# Altium schematic sheet ADCMP.SchDoc
size A4; SheetNumber: 2; SheetTotal: 5
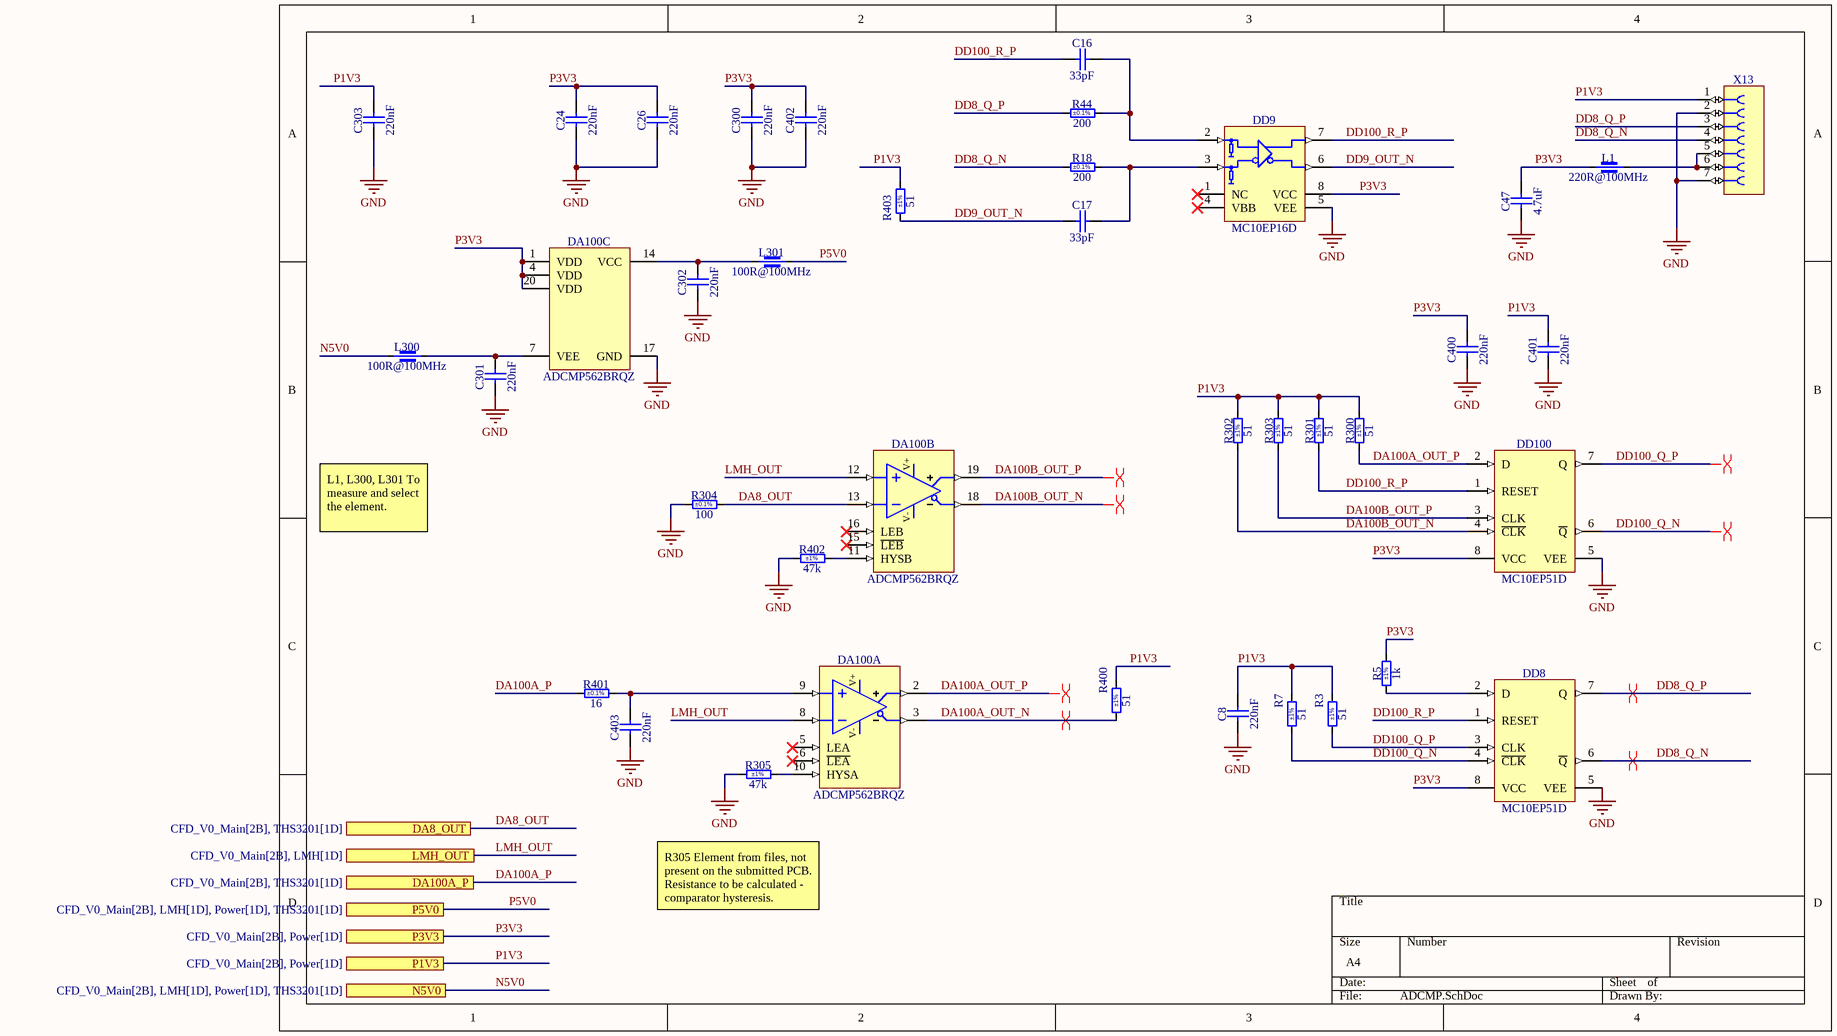
[diagram p0: ADCMP.SchDoc]

## Parts
C8  220nF  [CAPC2012X135N]
C16  33pF  [CAPC2012X135N]
C17  33pF  [CAPC2012X135N]
C24  220nF  [CAPC2012X135N]
C26  220nF  [CAPC2012X135N]
C47  4.7uF  [CAPC3216X180N]
C300  220nF  [CAPC1608X87N]
C301  220nF  [CAPC1608X87N]
C302  220nF  [CAPC1608X87N]
C303  220nF  [CAPC2012X135N]
C400  220nF  [CAPC2012X135N]
C401  220nF  [CAPC2012X135N]
C402  220nF  [CAPC1608X87N]
C403  220nF  [CAPC1608X87N]
DA100  ADCMP562BRQZ  [SOP63P600X175-20AN]  (parts A,B,C of 3)
DD8  MC10EP51D  [SOIC127P600X175-8N]
DD9  MC10EP16D  [SOIC127P600X175-8N]
DD100  MC10EP51D  [SOIC127P600X175-8N]
L1  220R@100MHz  [INDC2012X105N]
L300  100R@100MHz  [INDC1608X75N]
L301  100R@100MHz  [INDC1608X75N]
R3  51  Tolerance: ±1%  [RESC2012X60N]
R5  1k  Tolerance: ±1%  [RESC2012X60N]
R7  51  Tolerance: ±1%  [RESC2012X60N]
R18  200  Tolerance: ±0.1%  [RESC2012X60N]
R44  200  Tolerance: ±0.1%  [RESC2012X60N]
R300  51  Tolerance: ±1%  [RESC2012X60N]
R301  51  Tolerance: ±1%  [RESC2012X60N]
R302  51  Tolerance: ±1%  [RESC2012X60N]
R303  51  Tolerance: ±1%  [RESC2012X60N]
R304  100  Tolerance: ±0.1%  [RESC1608X55N]
R305  47k  Tolerance: ±1%  [RESC1608X55N]
R400  51  Tolerance: ±1%  [RESC2012X60N]
R401  16  Tolerance: ±0.1%  [RESC1608X64N]
R402  47k  Tolerance: ±1%  [RESC1608X55N]
R403  51  Tolerance: ±1%  [RESC2012X60N]
X13  Socket 7  [SAMTEC_CES-107-01-T-S]  (value not drawn)

## Ports
DA8_OUT (see CFD_V0_Main[2B], THS3201[1D]), DA100A_P (see CFD_V0_Main[2B], THS3201[1D]), LMH_OUT (see CFD_V0_Main[2B], LMH[1D]), N5V0 (see CFD_V0_Main[2B], LMH[1D], Power[1D], THS3201[1D]), P1V3 (see CFD_V0_Main[2B], Power[1D]), P3V3 (see CFD_V0_Main[2B], Power[1D]), P5V0 (see CFD_V0_Main[2B], LMH[1D], Power[1D], THS3201[1D])

## Nets
GND: C8.1 C24.1 C26.1 C47.1 C300.1 C301.1 C302.1 C303.1 C400.1 C401.1 C402.1 C403.1 DA100.17(GND) DD8.5(VEE) DD9.5(VEE) DD100.5(VEE) R304.1 R305.1 R402.1 X13.2 X13.7
DA8_OUT: DA100.13(-INB) R304.2 ; port DA8_OUT
DA100A_OUT_N: DA100.3(~{QA}) R400.1
DA100A_OUT_P: DA100.2(QA) DD100.2(D) R300.1
DA100A_P: R401.1 ; port DA100A_P
DA100B_OUT_N: DA100.18(~{QB}) DD100.4(~{CLK}) R302.1
DA100B_OUT_P: DA100.19(QB) DD100.3(CLK) R303.1
DD8_Q_N: DD8.6(~{Q}) R18.1 X13.4
DD8_Q_P: DD8.7(Q) R44.1 X13.3
DD9_OUT_N: C17.1 DD9.6(~{Q}) R403.1
DD100_Q_N: DD8.4(~{CLK}) DD100.6(~{Q}) R7.1
DD100_Q_P: DD8.3(CLK) DD100.7(Q) R3.1
DD100_R_P: C16.1 DD8.1(RESET) DD9.7(Q) DD100.1(RESET) R301.1
LMH_OUT: DA100.8(-INA) DA100.12(+INB) ; port LMH_OUT
N5V0: L300.1 ; port N5V0
P1V3: C8.2 C303.2 C401.2 R3.2 R7.2 R300.2 R301.2 R302.2 R303.2 R400.2 R403.2 X13.1 ; port P1V3
P3V3: C24.2 C26.2 C47.2 C300.2 C400.2 C402.2 DA100.1(VDD) DA100.4(VDD) DA100.20(VDD) DD8.8(VCC) DD9.8(VCC) DD100.8(VCC) L1.1 R5.2 ; port P3V3
P5V0: L301.2 ; port P5V0
NetC16_2: C16.2 DD9.2(D0) R44.2
NetC17_2: C17.2 DD9.3(~{D0}) R18.2
NetC301_2: C301.2 DA100.7(VEE) L300.2
NetC302_2: C302.2 DA100.14(VCC) L301.1
NetC403_2: C403.2 DA100.9(+INA) R401.2
NetDA100_10: DA100.10(HYSA) R305.2
NetDA100_11: DA100.11(HYSB) R402.2
NetDD8_2: DD8.2(D) R5.1
NetL1_2: L1.2 X13.5 X13.6

Not connected (* = marked no-connect by the designer): DA100 5(LEA)* 6(~{LEA})* 15(~{LEB})* 16(LEB)*; DD9 1(NC)* 4(VBB)*

## Layout directives
differential pair: DA100A_OUT_N, DA100A_OUT_P, DA100B_OUT_N, DA100B_OUT_P, DD8_Q_N, DD8_Q_P, DD100_Q_N, DD100_Q_P

## Notes on the sheet
- L1, L300, L301 To measure and select the element.
- R305 Element from files, not present on the submitted PCB. Resistance to be calculated - comparator hysteresis.
- (in symbol ADCMP562BRQZ, part A) V+; V-
- (in symbol ADCMP562BRQZ, part B) V+; V-

## Library data of the parts
C8 C24 C26 C303 C400 C401 = CC0805_220NF_50V_10%_X7R: Non-polarised capacitor; Part Description: SMD Multilayer Chip Ceramic Capacitor; Manufacturer: GENERIC; Manufacturer1 Part Number: GRM21BR71H224KA01L; Voltage: 50V; TC: X7R; Tolerance: ±10%; Part Number: CC0805_220NF_50V_10%_X7R; Component Kind: Standard; Component Type: Standard; Pin Count: 2; Value: 220nF; Status: Preferred; Manufacturer Part Number: CC0805_220NF_50V_10%_X7R; Case: 0805; Mounted: Yes; Socket: No; SMD: Yes; Sense: No; Manufacturer1 Example: MURATA; Manufacturer1 ComponentHeight: 1.35mm; HelpURL: \\cern.ch\dfs\Applications\Altium\Datasheets\CC0805_X7R_MURATA.pdf; Author: CERN DEM JLC; CreateDate: 03.12.2007; LatestRevisionDate: 03.12.2007
C16 C17 = CC0805_33PF_50V_5%_NP0: Non-polarised capacitor; Part Description: SMD Multilayer Chip Ceramic Capacitor; Manufacturer: GENERIC; Manufacturer1 Part Number: 223886115339; Voltage: 50V; TC: C0G/NP0; Tolerance: ±5%; Part Number: CC0805_33PF_50V_5%_NP0; Component Kind: Standard; Component Type: Standard; Pin Count: 2; Value: 33pF; Status: Preferred; Manufacturer Part Number: CC0805_33PF_50V_5%_NP0; Case: 0805; Mounted: Yes; Socket: No; SMD: Yes; Sense: No; Manufacturer1 Example: PHYCOMP; Manufacturer1 ComponentHeight: 1.35mm; HelpURL: \\cern.ch\dfs\Applications\Altium\Datasheets\CC0805_NP0_PHYCOMP.pdf; Author: CERN DEM JLC; CreateDate: 03.12.2007; LatestRevisionDate: 03.12.2007
C47 = CC1206_4.7UF_25V_10%_X7R: Non-polarised capacitor; Part Description: SMD Multilayer Chip Ceramic Capacitor; Manufacturer: GENERIC; Manufacturer1 Part Number: C1206C475K3RAC; Voltage: 25V; TC: X7R; Tolerance: ±10%; Part Number: CC1206_4.7UF_25V_10%_X7R; Component Kind: Standard; Component Type: Standard; Pin Count: 2; Value: 4.7uF; Status: Preferred; Manufacturer Part Number: CC1206_4.7UF_25V_10%_X7R; Case: 1206; Mounted: Yes; Socket: No; SMD: Yes; Sense: No; Manufacturer1 Example: KEMET; Manufacturer1 ComponentHeight: 1.8mm; HelpURL: \\cern.ch\dfs\Applications\Altium\Datasheets\CC1206_X7R_KEMET.pdf; Author: CERN DEM WB; CreateDate: 25.07.2018; LatestRevisionDate: 25.07.2018
C300-C302 C402 C403 = CC0603_220NF_25V_10%_X7R: Non-polarised capacitor; Part Description: SMD Multilayer Chip Ceramic Capacitor; Manufacturer: GENERIC; Manufacturer1 Part Number: C0603C224K3RACTU; Voltage: 25V; TC: X7R; Tolerance: ±10%; Part Number: CC0603_220NF_25V_10%_X7R; Component Kind: Standard; Component Type: Standard; Pin Count: 2; Value: 220nF; Status: Preferred; Manufacturer Part Number: CC0603_220NF_25V_10%_X7R; Case: 0603; Mounted: Yes; Socket: No; SMD: Yes; Sense: No; Manufacturer1 Example: KEMET; Manufacturer1 ComponentHeight: 0.87mm; HelpURL: \\cern.ch\dfs\Applications\Altium\Datasheets\CC0603_X7R_KEMET.pdf; Author: CERN DEM JLC; CreateDate: 29.10.2014; LatestRevisionDate: 29.10.2014
DA100 = ADCMP562BRQZ: Dual, High Speed PECL Comparators; Part Description: Dual High Speed PECL Comparators; Manufacturer: ANALOG DEVICES; PressFit: No; Bonding: No; Part Number: ADCMP562BRQZ; Component Kind: Standard; Component Type: Standard; Device: ADCMP562BRQZ; PackageDescription: SOP, 0.635mm Pitch; 20 Pin, 3.90mm W X 8.65mm L X 1.75mm H Body, IPC Medium Density; Manufacturer Part Number: ADCMP562BRQ; Pin Count: 20; Case: SSOP20; Mounted: Yes; Socket: No; SMD: Yes; Sense: No; ComponentHeight: 1.75mm; Author: CERN DEM MR; HelpURL: \\cern.ch\dfs\Applications\Altium\Datasheets\ADCMP562BRQZ.pdf; CreateDate: 15.02.2018; LatestRevisionDate: 31.03.2022
DD8 DD100 = MC10EP51D: 3.3V/5V ECL D Flip-Flop with Reset and Differential Clock; Manufacturer: ON SEMICONDUCTOR; PressFit: No; Bonding: No; Part Number: MC10EP51D; Component Kind: Standard; Component Type: Standard; Device: MC10EP51D; PackageDescription: SOIC 8, Pitch 1.27mm - Body 4x5mm, IPC Medium Density; Part Description: 3.3V/5V ECL D Flip-Flop with Reset and Differential Clock; Manufacturer Part Number: MC10EP51D; Pin Count: 8; Case: SOIC8; Mounted: Yes; Socket: No; SMD: Yes; Sense: No; ComponentHeight: 1.75mm; Author: CERN DEM HF; HelpURL: \\cern.ch\dfs\Applications\Altium\Datasheets\MC10EP51.pdf; CreateDate: 25.04.2024; LatestRevisionDate: 25.04.2024
DD9 = MC10EP16D: 3.3V / 5V ECL Differential Receiver/Driver; Manufacturer: ON SEMICONDUCTOR; PressFit: No; Bonding: No; Part Number: MC10EP16D; Component Kind: Standard; Component Type: Standard; Device: MC10EP16D; PackageDescription: SOIC 8, Pitch 1.27mm - Body 4x5mm, IPC Medium Density; Part Description: 3.3V/5V ECL Differential Receiver/Driver; Manufacturer Part Number: MC10EP16D; Pin Count: 8; Case: SOIC8; Mounted: Yes; Socket: No; SMD: Yes; Sense: No; ComponentHeight: 1.75mm; Author: CERN DEM HF; HelpURL: \\cern.ch\dfs\Applications\Altium\Datasheets\MC10EP16.pdf; CreateDate: 25.04.2024; LatestRevisionDate: 25.04.2024
L1 = IND0805_TDK_MPZ2012S221A: Part Description: SMT Chip Bead for General Power Line (MPZ Series); Manufacturer: TDK; Power: 3A; Resistance: 0.04R; Tolerance: ±25%; Part Number: IND0805_TDK_MPZ2012S221A; Component Kind: Standard; Component Type: Standard; Pin Count: 2; Value: 220R@100MHz; Manufacturer Part Number: MPZ2012S221A; Case: 0805; Mounted: Yes; Socket: No; SMD: Yes; Sense: No; ComponentHeight: 1.05mm; HelpURL: \\cern.ch\dfs\Applications\Altium\Datasheets\IND0805_TDK_MPZ2012.pdf; Author: CERN DEM HF; CreateDate: 04.10.2021; LatestRevisionDate: 04.10.2021
L300 L301 = IND0603_TDK_MPZ1608S101ATAH0: Part Description: SMT Chip Bead for Power Line; Manufacturer: TDK; Power: 3A; Resistance: 0.03R; Tolerance: ±25%; Part Number: IND0603_TDK_MPZ1608S101ATAH0; Component Kind: Standard; Component Type: Standard; Pin Count: 2; Value: 100R@100MHz; Manufacturer Part Number: MPZ1608S101ATAH0; Case: 0603; Mounted: Yes; Socket: No; SMD: Yes; Sense: No; ComponentHeight: 0.75mm; HelpURL: \\cern.ch\dfs\Applications\Altium\Datasheets\IND0603_TDK_MPZ1608.pdf; Author: CERN DEM JMW; CreateDate: 09.07.2015; LatestRevisionDate: 25.10.2018
R3 R7 R300-R303 R400 R403 = R0805_51R_1%_0.125W_100PPM: Resistor - 1%; Part Description: General Purpose Thick Film Chip Resistor; Manufacturer: GENERIC; Manufacturer1 Part Number: NRC10F51R0TRF; Power: 0.125W; TC: ±100ppm/°C; PressFit: No; Part Number: R0805_51R_1%_0.125W_100PPM; Component Kind: Standard; Component Type: Standard; Pin Count: 2; Value: 51; Status: Preferred; Manufacturer Part Number: R0805_51R_1%_0.125W_100PPM; Case: 0805; Mounted: Yes; Sense: No; Socket: No; SMD: Yes; Manufacturer1 Example: NIC COMPONENT; Manufacturer1 ComponentHeight: 0.6mm; HelpURL: \\cern.ch\dfs\Applications\Altium\Datasheets\R0805_NIC_NRC.pdf; Author: CERN DEM JLC; CreateDate: 03.12.2007; LatestRevisionDate: 13.03.2008
R5 = R0805_1K_1%_0.125W_100PPM: Resistor - 1%; Part Description: General Purpose Thick Film Chip Resistor; Manufacturer: GENERIC; Manufacturer1 Part Number: NRC10F1001TRF; Power: 0.125W; TC: ±100ppm/°C; PressFit: No; Part Number: R0805_1K_1%_0.125W_100PPM; Component Kind: Standard; Component Type: Standard; Pin Count: 2; Value: 1k; Status: Preferred; Manufacturer Part Number: R0805_1K_1%_0.125W_100PPM; Case: 0805; Mounted: Yes; Sense: No; Socket: No; SMD: Yes; Manufacturer1 Example: NIC COMPONENT; Manufacturer1 ComponentHeight: 0.6mm; HelpURL: \\cern.ch\dfs\Applications\Altium\Datasheets\R0805_NIC_NRC.pdf; Author: CERN DEM JLC; CreateDate: 03.12.2007; LatestRevisionDate: 13.03.2008
R18 R44 = R0805_200R_0.1%_0.1W_10PPM: Resistor - 0.1%; Part Description: Thin Film Chip Resistor; Manufacturer: GENERIC; Manufacturer1 Part Number: RN73C2A200RBTG; Power: 0.1W; TC: ±10ppm; PressFit: No; Part Number: R0805_200R_0.1%_0.1W_10PPM; Component Kind: Standard; Component Type: Standard; Pin Count: 2; Value: 200; Status: Not Recommended; Manufacturer Part Number: R0805_200R_0.1%_0.1W_10PPM; Case: 0805; Mounted: Yes; Sense: No; Socket: No; SMD: Yes; Manufacturer1 Example: TYCO HOLSWORTHY; Manufacturer1 ComponentHeight: 0.6mm; HelpURL: \\cern.ch\dfs\Applications\Altium\Datasheets\R0805_Tyco_RN73.pdf; Author: CERN DEM JLC; CreateDate: 03.12.2007; LatestRevisionDate: 13.03.2008
R304 = R0603_100R_0.1%_0.1W_10PPM_VISHAY_MCT: Resistor - 0.1%; Part Description: Precision Thin Film Chip Resistor; Manufacturer: VISHAY BEYSCHLAG; Manufacturer Part Number: MCT06030F1000B; Power: 0.1W; TC: ±10ppm/°C; PressFit: No; Part Number: R0603_100R_0.1%_0.1W_10PPM_VISHAY_MCT; Component Kind: Standard; Component Type: Standard; Pin Count: 2; Value: 100; Status: Not Recommended; Case: 0603; Mounted: Yes; Sense: No; Socket: No; SMD: Yes; ComponentHeight: 0.55mm; HelpURL: \\cern.ch\dfs\Applications\Altium\Datasheets\R0603_VISHAY_MCT-Precision.pdf; Author: CERN DEM BC; CreateDate: 25.08.2020; LatestRevisionDate: 28.06.2022
R305 R402 = R0603_47K_1%_0.1W_100PPM: Resistor - 1%; Part Description: General Purpose Thick Film Chip Resistor; Manufacturer: GENERIC; Manufacturer1 Part Number: NRC06F4702TRF; Power: 0.1W; TC: ±100ppm/°C; PressFit: No; Part Number: R0603_47K_1%_0.1W_100PPM; Component Kind: Standard; Component Type: Standard; Pin Count: 2; Value: 47k; Status: Preferred; Manufacturer Part Number: R0603_47K_1%_0.1W_100PPM; Case: 0603; Mounted: Yes; Sense: No; Socket: No; SMD: Yes; Manufacturer1 Example: NIC COMPONENT; Manufacturer1 ComponentHeight: 0.55mm; HelpURL: \\cern.ch\dfs\Applications\Altium\Datasheets\R0603_NIC_NRC.pdf; Author: CERN DEM JLC; CreateDate: 03.12.2007; LatestRevisionDate: 13.03.2008
R401 = R0603_16R_0.1%_0.1W_10PPM: Resistor - 0.1%; Part Description: Thin Film Chip Resistor; Manufacturer: GENERIC; Manufacturer1 Part Number: RT0603BRB0716RL; Power: 0.1W; TC: ±10ppm/°C; PressFit: No; Part Number: R0603_16R_0.1%_0.1W_10PPM; Component Kind: Standard; Component Type: Standard; Pin Count: 2; Value: 16; Status: Not Recommended; Manufacturer Part Number: R0603_16R_0.1%_0.1W_10PPM; Case: 0603; Mounted: Yes; Sense: No; Socket: No; SMD: Yes; Manufacturer1 Example: YAGEO; Manufacturer1 ComponentHeight: 0.55mm; HelpURL: \\cern.ch\dfs\Applications\Altium\Datasheets\R0603_YAGEO_RT.pdf; Author: CERN DEM HF; CreateDate: 25.04.2024; LatestRevisionDate: 25.04.2024
X13 = SAMTEC_CES-107-01-L-S: Connector 7 Female; Part Description: 7 Contacts, Pitch 2.54mm, Single Row Through Mount Straight Socket (Lead Length 3.25mm); Manufacturer: SAMTEC; PressFit: No; Author: CERN DEM HF; Part Number: SAMTEC_CES-107-01-L-S; Component Kind: Standard; Component Type: Standard; Pin Count: 7; Family: Socket 7; Mounted: Yes; Socket: No; SMD: No; Sense: No; Status: None; Manufacturer Part Number: CES-107-01-L-S; ComponentHeight: 5.08mm; HelpURL: \\cern.ch\dfs\Applications\Altium\Datasheets\SAMTEC_CES-107-01-T-S.pdf; CreateDate: 25.04.2024; LatestRevisionDate: 25.04.2024